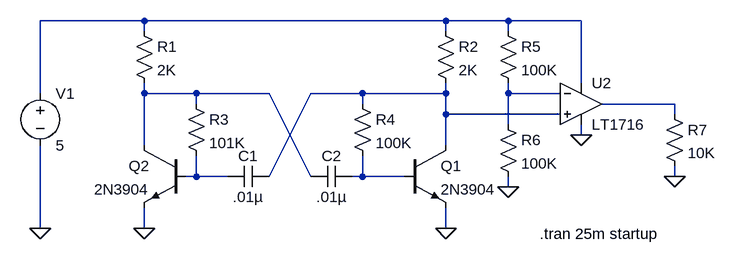
[diagram p0: schematic xprobe.asc]
xprobe.asc, the LTspice schematic file:
Version 4
SHEET 1 888 1240
WIRE -720 848 -720 736
WIRE -720 1056 -720 928
WIRE -560 736 -720 736
WIRE -560 752 -560 736
WIRE -560 848 -560 832
WIRE -560 928 -560 848
WIRE -560 1056 -560 1024
WIRE -480 848 -560 848
WIRE -480 864 -480 848
WIRE -480 976 -496 976
WIRE -480 976 -480 944
WIRE -432 976 -480 976
WIRE -368 848 -480 848
WIRE -304 848 -368 976
WIRE -304 976 -368 848
WIRE -224 848 -304 848
WIRE -224 864 -224 848
WIRE -224 976 -240 976
WIRE -224 976 -224 944
WIRE -160 976 -224 976
WIRE -96 736 -560 736
WIRE -96 752 -96 736
WIRE -96 848 -224 848
WIRE -96 848 -96 832
WIRE -96 880 -96 848
WIRE -96 928 -96 880
WIRE -96 1056 -96 1024
WIRE 0 736 -96 736
WIRE 0 752 0 736
WIRE 0 848 0 832
WIRE 0 896 0 848
WIRE 0 992 0 976
WIRE 80 848 0 848
WIRE 80 880 -96 880
WIRE 112 736 0 736
WIRE 112 832 112 736
WIRE 112 912 112 896
WIRE 256 864 144 864
WIRE 256 880 256 864
WIRE 256 976 256 960
FLAG -96 1056 0
FLAG -560 1056 0
FLAG -720 1056 0
FLAG 112 912 0
FLAG 0 992 0
FLAG 256 976 0
SYMBOL RES -576 736 R0
SYMATTR InstName R1
SYMATTR Value 2K
SYMBOL res -112 736 R0
SYMATTR InstName R2
SYMATTR Value 2K
SYMBOL res -496 848 R0
SYMATTR InstName R3
SYMATTR Value 101K
SYMBOL res -240 848 R0
SYMATTR InstName R4
SYMATTR Value 100K
SYMBOL cap -368 960 R90
WINDOW 0 0 32 VBottom 0
WINDOW 3 32 32 VTop 0
SYMATTR InstName C1
SYMATTR Value .01µ
SYMBOL cap -240 960 R90
WINDOW 0 0 32 VBottom 0
WINDOW 3 32 32 VTop 0
SYMATTR InstName C2
SYMATTR Value .01µ
SYMBOL VOLTAGE -720 832 R0
SYMATTR InstName V1
SYMATTR Value 5
SYMBOL NPN -160 928 R0
SYMATTR InstName Q1
SYMATTR Value 2N3904
SYMBOL npn -496 928 M0
SYMATTR InstName Q2
SYMATTR Value 2N3904
SYMBOL Comparators\\LT1716 112 864 R0
SYMATTR InstName U2
SYMBOL res -16 736 R0
SYMATTR InstName R5
SYMATTR Value 100K
SYMBOL res -16 880 R0
SYMATTR InstName R6
SYMATTR Value 100K
SYMBOL res 240 864 R0
SYMATTR InstName R7
SYMATTR Value 10K
TEXT 48 1064 Left 0 !.tran 25m startup

The netlist it stands for:
* xprobe.asc
R1 N001 N002 2K
R2 N001 N004 2K
R3 N002 N003 101K
R4 N004 N005 100K
C1 N004 N003 .01µ
C2 N005 N002 .01µ
V1 N001 0 5
Q1 N004 N005 0 0 2N3904
Q2 N002 N003 0 0 2N3904
XU2 N004 N006 N001 0 N007 LT1716  ; pins In+ In- V+ V- OUT
R5 N001 N006 100K
R6 N006 0 100K
R7 N007 0 10K
.model NPN NPN
.model PNP PNP
.lib standard.bjt
.tran 25m startup
.lib LTC1.lib
.backanno
.end